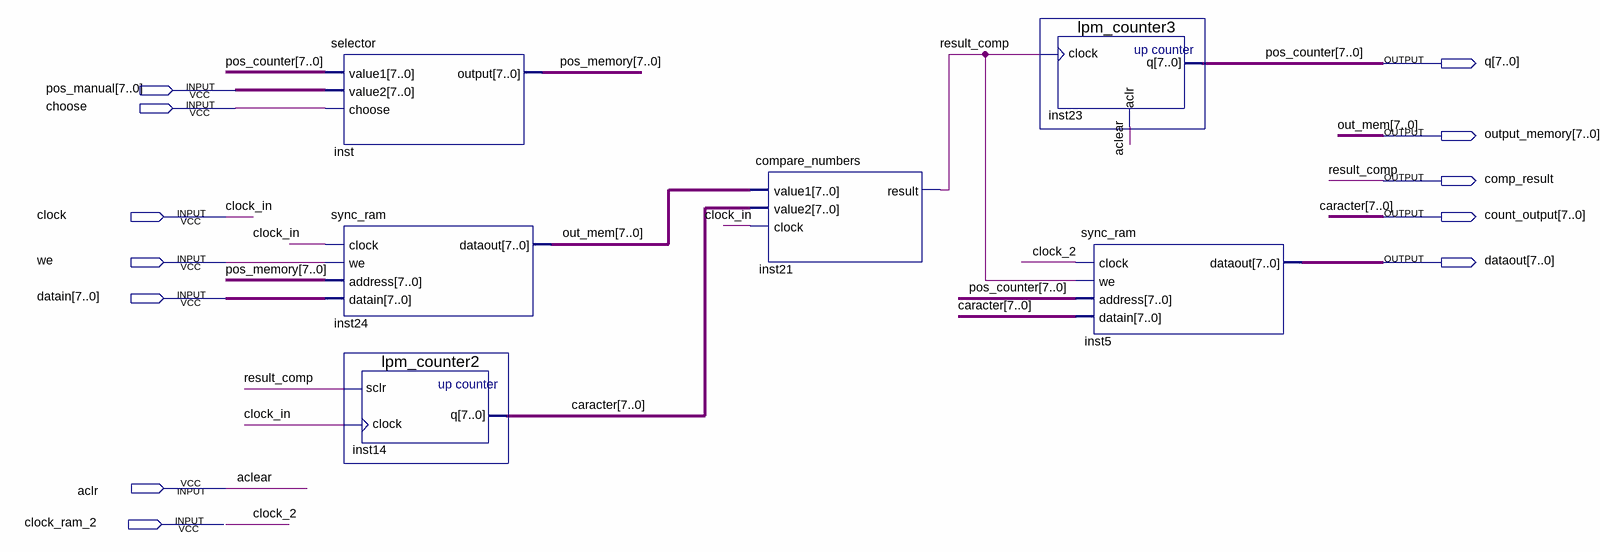
[diagram p0: schematic sheet]
// Quartus schematic projeto_final_forca_bruta.bdf as structural Verilog: 6 symbols, 12 pins
module projeto_final_forca_bruta (
  input  [7:0] pos_manual,
  input  choose,
  input  clock,
  input  we,
  input  [7:0] datain,
  input  aclr,
  input  clock_ram_2,
  output [7:0] q,
  output [7:0] output_memory,
  output comp_result,
  output [7:0] count_output,
  output [7:0] dataout
);

  wire [7:0] pos_memory;

  selector inst (.value1(q), .value2(pos_manual), .choose(choose), .\output (pos_memory));
  sync_ram inst24 (.clock(clock), .we(we), .address(pos_memory), .datain(datain), .dataout(output_memory));
  lpm_counter2 inst14 (.sclr(comp_result), .clock(clock), .q(count_output));
  compare_numbers inst21 (.value1(output_memory), .value2(count_output), .clock(clock), .result(comp_result));
  lpm_counter3 inst23 (.clock(comp_result), .aclr(aclr), .q(q));
  sync_ram inst5 (.clock(clock_ram_2), .we(comp_result), .address(q), .datain(count_output), .dataout(dataout));

  // Other names for the same wires on the sheet: aclear = aclr; caracter[7:0] = count_output; clock_2 = clock_ram_2;
  //   clock_in = clock; out_mem[7:0] = output_memory; pos_counter[7:0] = q; result_comp = comp_result
endmodule
